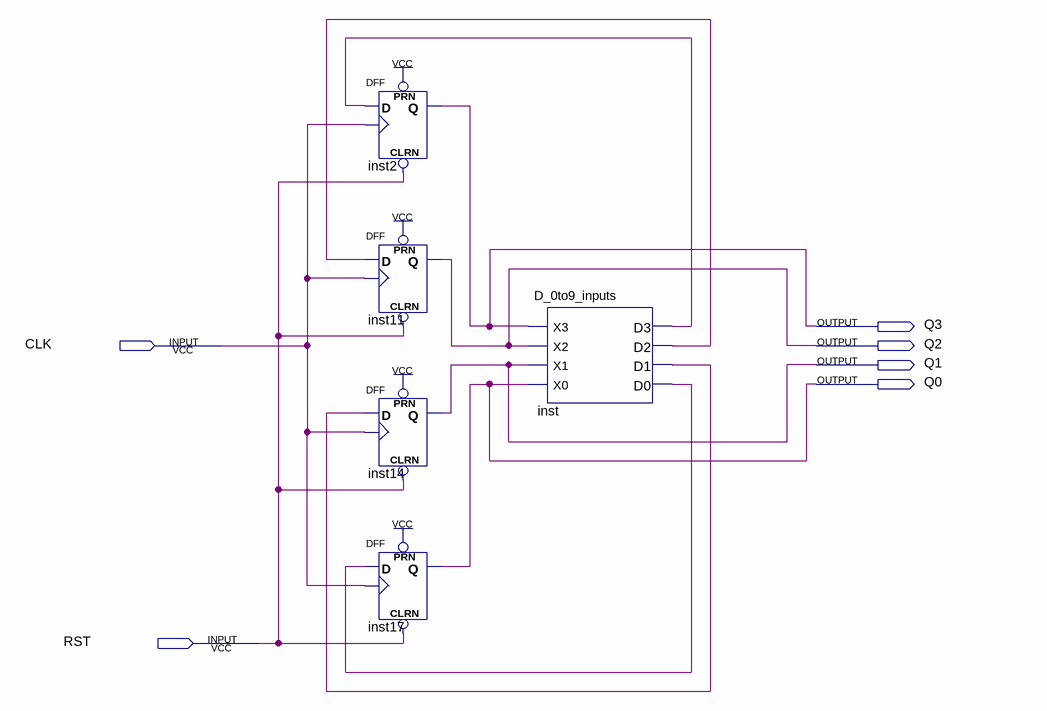
[diagram p0: schematic sheet]
// Quartus schematic 0to9_up_counter.bdf as structural Verilog: 5 symbols, 6 pins
module \0to9_up_counter  (
  input  CLK,
  input  RST,
  output Q3,
  output Q2,
  output Q1,
  output Q0
);

  wire inst_d0, inst_d1, inst_d2, inst_d3;

  DFF inst2 (.CLRN(RST), .CLK(CLK), .D(inst_d3), .PRN(1'b1), .Q(Q3));
  DFF inst11 (.CLRN(RST), .CLK(CLK), .D(inst_d2), .PRN(1'b1), .Q(Q2));
  DFF inst14 (.CLRN(RST), .CLK(CLK), .D(inst_d1), .PRN(1'b1), .Q(Q1));
  DFF inst17 (.CLRN(RST), .CLK(CLK), .D(inst_d0), .PRN(1'b1), .Q(Q0));
  D_0to9_inputs inst (.X3(Q3), .X2(Q2), .X1(Q1), .X0(Q0), .D3(inst_d3), .D2(inst_d2), .D1(inst_d1), .D0(inst_d0));
endmodule
